# EAGLE design puenteH (EAGLE 9.6.2)
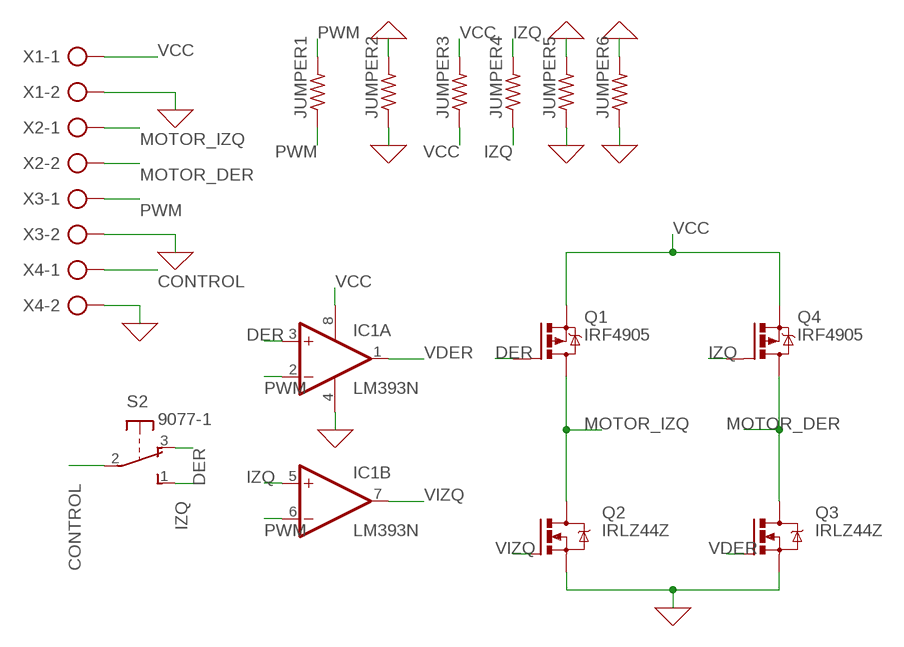
[diagram p0: schematic, sheet 1]

## Parts
IC1  LM393N  [DIL08]
JUMPER1  R-US_0204/5  [0204/5]
JUMPER2  R-US_0204/7  [0204/7]
JUMPER3  R-US_0204/5  [0204/5]
JUMPER4  R-US_0204/7  [0204/7]
JUMPER5  R-US_0204/5  [0204/5]
JUMPER6  R-US_0204/7  [0204/7]
Q1  IRF4905  [TO220BH]
Q2  IRLZ44Z  [TO220BH]
Q3  IRLZ44Z  [TO220BH]
Q4  IRF4905  [TO220BH]
S2  9077-1  [9077-1]
X1  AK300/2  [AK300/2]
X2  AK300/2  [AK300/2]
X3  AK300/2  [AK300/2]
X4  AK300/2  [AK300/2]

## Nets
0: IC1.4(P:V-) JUMPER2.1 JUMPER2.2 JUMPER5.1 JUMPER5.2 JUMPER6.1 JUMPER6.2 Q2.S Q3.S X1.2 X3.2 X4.2 ; supply symbol labelled GND
CONTROL: S2.2(P) X4.1
DER: IC1.3(A:+IN) Q1.G S2.3(O)
IZQ: IC1.5(B:+IN) JUMPER4.1 JUMPER4.2 Q4.G S2.1(S)
MOTOR_DER: Q3.D Q4.D X2.2
MOTOR_IZQ: Q1.D Q2.D X2.1
PWM: IC1.2(A:-IN) IC1.6(B:-IN) JUMPER1.1 JUMPER1.2 X3.1
VCC: IC1.8(P:V+) JUMPER3.1 JUMPER3.2 Q1.S Q4.S X1.1
VDER: IC1.1(A:OUT) Q3.G
VIZQ: IC1.7(B:OUT) Q2.G

## Library data of the parts
IC1 = linear:LM393: COMPARATOR
JUMPER1-JUMPER6 = rcl:R-US_: RESISTOR, American symbol; SPICEPREFIX: R
Q1 Q4 = transistor-power:IRF4905: P-Channel HEXFET® Power MOSFET RDS(on)= 0.02 Ohm, ID = -74A Source: http://www.irf.com/product-info/datasheets/data/irf4905pbf.pdf
Q2 Q3 = transistor-power:IRLZ44Z: N-Channel HEXFET® Power MOSFET Logic Level AUTOMOTIVE MOSFET Source: http://www.irf.com/product-info/datasheets/data/irlz44zpbf.pdf
S2 = switch-misc:9077-1: MARQUARDT SWITCH 9077.0100 Distributor: Buerklin <https://www.buerklin.com/default.asp?event=ShowArtikel%2812G2820%29&l=d&jump=ArtNr_12G2820>
X1-X4 = con-ptr500:AK300/2: CONNECTOR; OC_FARNELL: unknown; OC_NEWARK: unknown

## Board
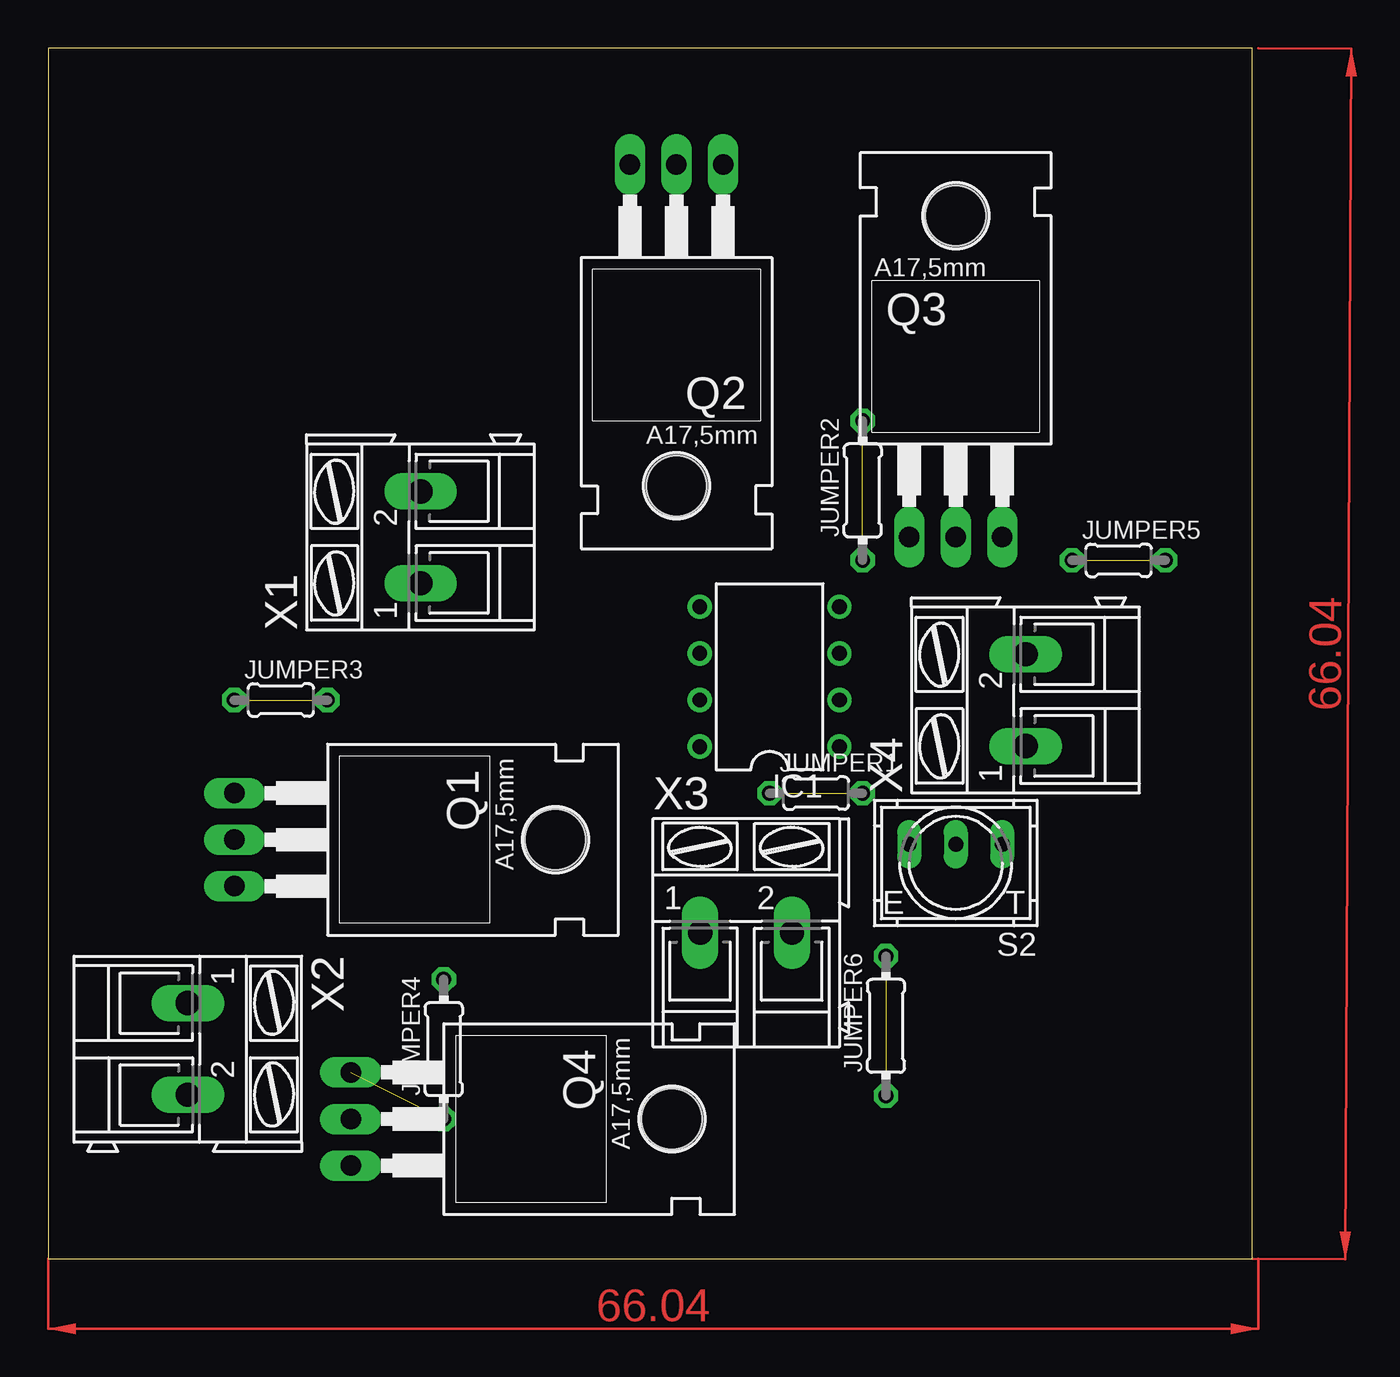
[diagram p1: board, top side]
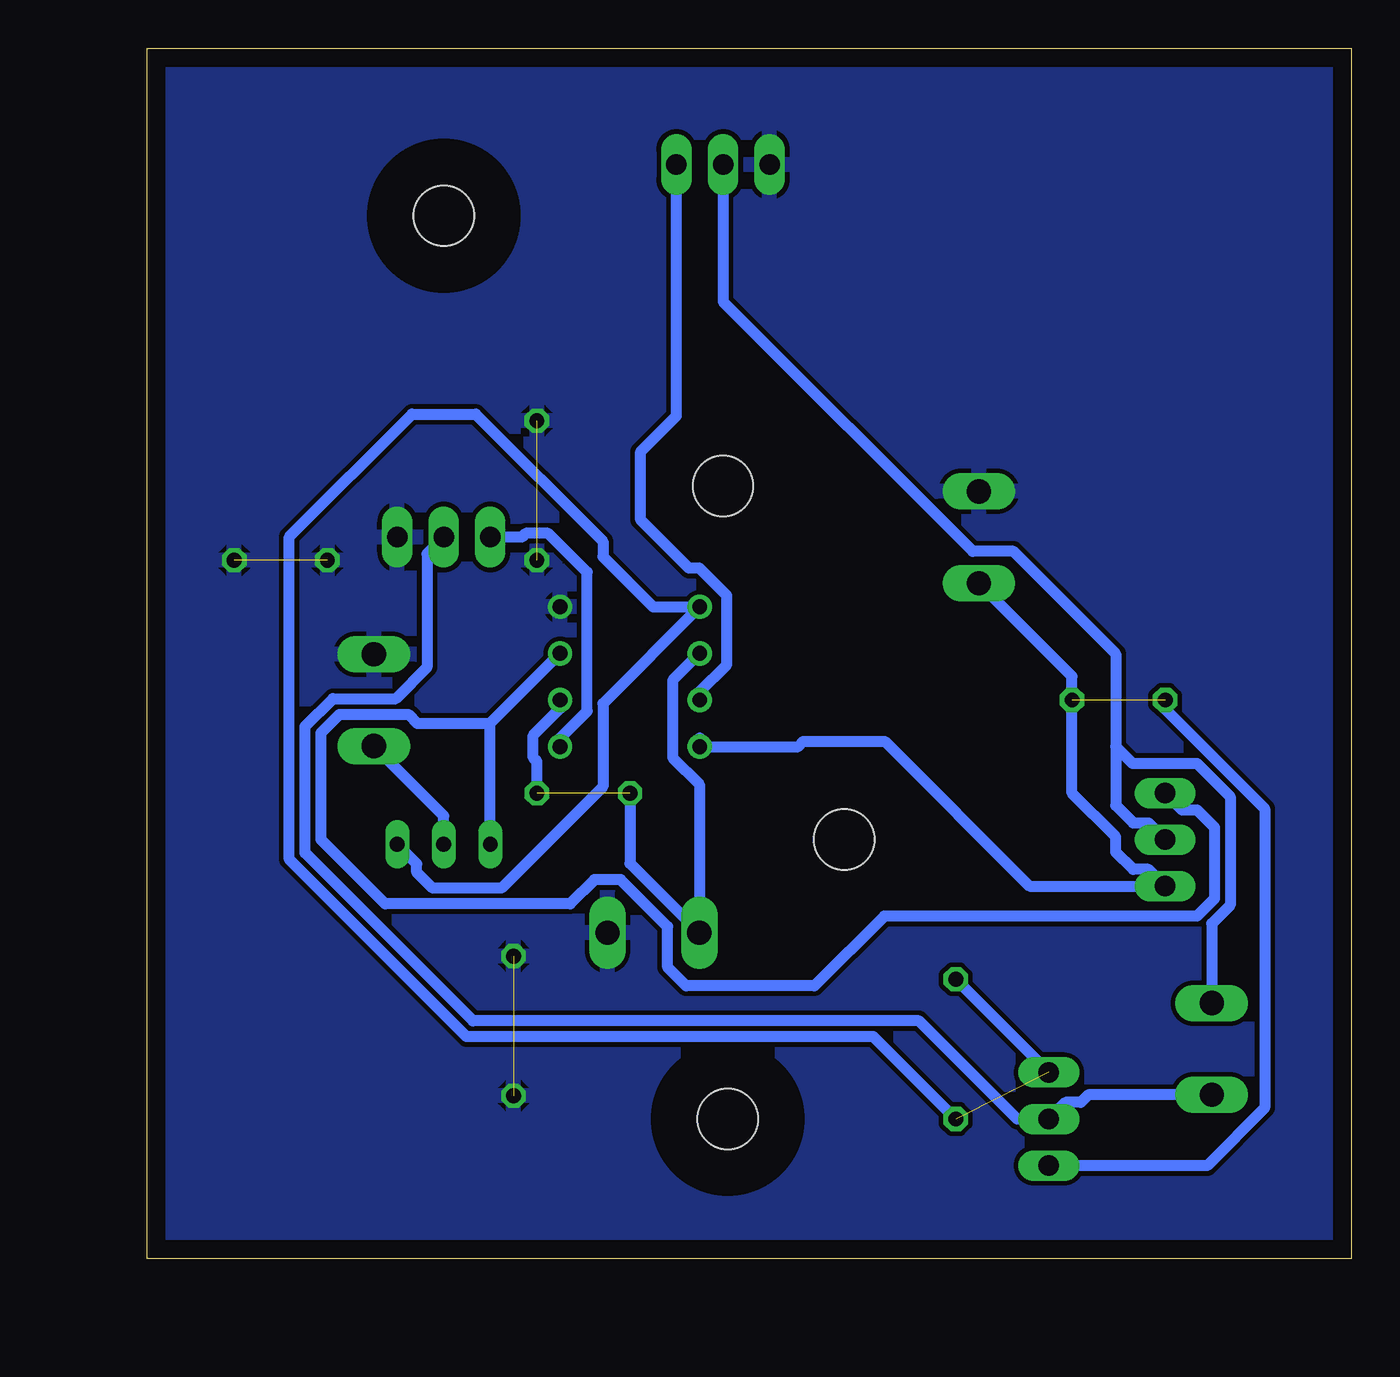
[diagram p2: board, bottom side, seen from below]

Size 65.71 x 66.03 mm. Coordinates in mm from the lower left corner, seen from the top.
Outline: 0,0 65.71,0 65.71,66.03 0,66.03 0,0
Copper layers (1*16): Top 0.035mm / dielectric 1.5mm / Bottom 0.035mm
Design rules "default *": minimum track width 24mil, minimum drill 0.35mm, track to track 10mil, track to pad 10mil, pad to pad 10mil, via to via 10mil, smd to smd 10mil, copper to edge 40mil, drill to drill 6mil, minimum pad ring 10mil, minimum via ring 8mil, stop-mask expansion 4mil, vias tented up to drill 0mil, thermal gap 10mil

### Footprints (pad centres in the part's own frame; a part is rotated, then mirrored left to right if it is on the bottom)
DIL08 = drill 0.813 pad 1.27: 1 -3.81,-3.81; 2 -1.27,-3.81; 3 1.27,-3.81; 4 3.81,-3.81; 5 3.81,3.81; 6 1.27,3.81; 7 -1.27,3.81; 8 -3.81,3.81
0204/5 = drill 0.813 octagon: 1 -2.54,0; 2 2.54,0
0204/7 = drill 0.813 octagon: 1 -3.81,0; 2 3.81,0
TO220BH = drill 1.118 long: D 0,-6.35; G -2.54,-6.35; S 2.54,-6.35 | hole 3.302: 0,11.176
9077-1 = drill 0.813 long: 1 -2.54,-1.016; 2 0,-1.016; 3 2.54,-1.016
AK300/2 = drill 1.321 long: 1 -2.515,0; 2 2.489,0

### Placement (x,y rotation side)
IC1  39.37,31.75 90 top
JUMPER1  41.91,25.4 0 top
JUMPER2  44.45,41.91 90 top
JUMPER3  12.7,30.48 0 top
JUMPER4  21.59,11.43 90 top
JUMPER5  58.42,38.1 0 top
JUMPER6  45.72,12.7 90 top
Q1  16.51,22.86 270 top
Q2  34.29,53.34 180 top
Q3  49.53,45.72 0 top
Q4  22.86,7.62 270 top
S2  49.53,21.59 180 top
X1  20.32,39.37 90 top
X2  7.62,11.43 270 top
X3  38.1,17.78 0 top
X4  53.34,30.48 90 top

### Tracks (layer width: path | path; a pad name or v marks a point on that pad's centre or on a via)
0  (3 unrouted)
  pour Bottom: 0,66.03 0,0 65.71,0 65.71,66.03
CONTROL
  Bottom 0.61: S2.2 49.53,24.16 X4.1
DER
  Bottom 0.61: 46.99,29.21 IC1.3 | Q1.G 9.25,24.49 8.42,24.49 7.47,23.53 7.47,19.65 8.42,18.69 25.49,18.69 29.3,14.88 36.3,14.88 37.31,15.9 37.31,18.11 39.87,20.68 41.3,20.68 42.62,19.36 52.73,19.36 56.24,22.86 56.24,28.68 55.22,29.69 51.46,29.69 50.97,29.21 46.99,29.21 | S2.3 46.99,29.21
IZQ  (1 unrouted)
  Bottom 0.61: S2.1 51,21.54 51,21.08 50.14,20.22 46.38,20.22 40.84,25.75 40.84,30.28 IC1.5 38.1,35.56 40.84,38.3 40.84,39.13 47.79,46.08 51.27,46.08 57.96,39.38 57.96,21.79 48.29,12.12 26.09,12.12 JUMPER4.1 | Q4.G JUMPER4.2
MOTOR_DER
  Bottom 0.61: Q3.D 50.44,38.46 50.44,32.25 52.14,30.56 55.58,30.56 57.1,29.04 57.1,22.15 47.93,12.98 23.6,12.98 18.24,7.62 Q4.D 15.6,8.53 14.77,8.53 14.36,8.94 X2.2
MOTOR_IZQ
  Bottom 0.61: Q1.D 11.07,23.77 11.9,23.77 12.85,24.73 12.85,27.94 | Q2.D 34.29,52.22 20.65,38.58 18.44,38.58 12.85,33 12.85,27.94 | X2.1 7.62,18.27 6.6,19.29 6.6,25.21 8.42,27.03 11.94,27.03 12.85,27.94
PWM  (1 unrouted)
  Bottom 0.61: IC1.6 37.03,31.55 37.03,27.33 35.59,25.88 X3.1 39.37,21.57 JUMPER1.1 | JUMPER1.2 44.45,27.13 44.65,27.33 44.65,28.55 43.18,30.02 IC1.2
VCC  (1 unrouted)
  Bottom 0.61: 35.56,28.4 IC1.8 30.18,27.94 29.91,28.22 25.47,28.22 17.57,20.32 Q1.S 11.07,21.23 11.9,21.23 12.85,22.19 12.85,23.01 15.24,25.4 JUMPER3.2 15.24,31.77 X1.1 | JUMPER3.1 10.16,29.99 4.72,24.55 4.72,8.22 7.87,5.08 Q4.S
VDER
  Bottom 0.61: IC1.1 43.18,28.4 41.71,29.87 41.71,37.45 43.83,39.57 45.06,39.57 45.26,39.37 Q3.G
VIZQ
  Bottom 0.61: IC1.7 35.56,30.94 34.09,32.41 34.09,36.17 35.59,37.67 36.15,37.67 38.79,40.3 38.79,44.03 36.83,45.98 Q2.G
(copper drawn outside any net)
  shapes: Top area x2